# Altium schematic sheet BlueBox-Amp [PA].SchDoc
size A
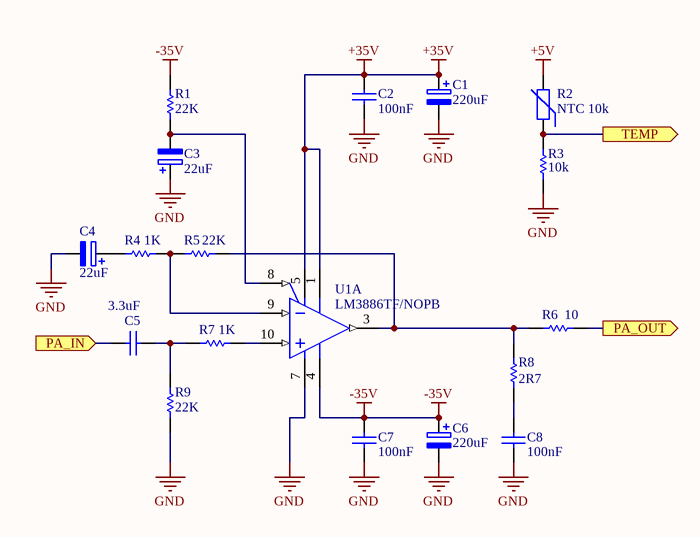
[diagram p0: BlueBox-Amp [PA].SchDoc]

## Parts
C1  value 220uF  [E5-10,5]  (hidden comment: Capacitor Polarized)
C2  value 100nF  [CAPC0603(1608)100_L]  (hidden comment: CAP 100nF 50V 0603(1608))
C3  value 22uF  [EC P2-D5-H11]  (hidden comment: Capacitor Polarized)
C4  value 22uF  [EC P2-D5-H11]  (hidden comment: Capacitor Polarized)
C5  value 3.3uF  [CAPC1210(3225)280_L]  (hidden comment: CAP 3.3uF 50V 1210(3225))
C6  value 220uF  [E5-10,5]  (hidden comment: Capacitor Polarized)
C7  value 100nF  [CAPC0603(1608)100_L]  (hidden comment: CAP 100nF 50V 0603(1608))
C8  value 100nF  [CAPC0603(1608)100_L]  (hidden comment: CAP 100nF 50V 0603(1608))
R1  value 22K  [RESC0603(1608)_L]  (hidden comment: 22K 1% 0603(1608))
R2  NTC 10k  [HDR1X2]
R3  value 10k  [RESC0603(1608)_N]  (hidden comment: 10K 1% 0603(1608))
R4  value 1K  [RESC0603(1608)_M]  (hidden comment: 1K 1% 0603(1608))
R5  value 22K  [RESC0603(1608)_L]  (hidden comment: 22K 1% 0603(1608))
R6  value 10  [RESC2512(6432)_L]  (hidden comment: 10R 5% 2512(6432))
R7  value 1K  [RESC0603(1608)_M]  (hidden comment: 1K 1% 0603(1608))
R8  value 2R7  [RESC2512(6432)_L]  (hidden comment: 2R7 5% 2512(6432))
R9  value 22K  [RESC0603(1608)_L]  (hidden comment: 22K 1% 0603(1608))
U1  LM3886TF/NOPB  [TI-NDA11]  (part A of 2)

## Ports
PA_IN, PA_OUT, TEMP

## Nets
+5V: R2.2
+35V: C1.1 C2.2 U1.1(V+) U1.5(V+)
-35V: C6.1 C7.2 R1.1 U1.4(V-)
GND: C1.2 C2.1 C3.1 C4.2 C6.2 C7.1 C8.2 R3.1 R9.2 U1.7(GND)
PA_IN: C5.1 ; port PA_IN
PA_OUT: R6.2 ; port PA_OUT
TEMP: R2.1 R3.2 ; port TEMP
NetC3_2: C3.2 R1.2 U1.8(MUTE)
NetC4_1: C4.1 R4.1
NetC5_2: C5.2 R7.1 R9.1
NetC8_1: C8.1 R8.1
NetR4_2: R4.2 R5.1 U1.9(VIN-)
NetR5_2: R5.2 R6.1 R8.2 U1.3(OUTPUT)
NetR7_2: R7.2 U1.10(VIN+)

## Library data of the parts
C1 C3 C4 C6 = Capacitor Polarized: Polarized Capacitor
C2 C7 C8 = CMP-1035-02591-1: CAP 100nF 50V ±5% 0603 (1608 Metric) Thickness 1mm SMD; Case-Metric: 1608; Case-EIA: 0603; Rated Voltage: 50 V; Max Thickness: 1 mm; Tolerance: ±5%; Technology: SMT
C5 = CMP-1038-02126-1: CAP 3.3uF 50V ±10% 1210 (3225 Metric) Thickness 2.8mm SMD; Case-Metric: 3225; Case-EIA: 1210; Technology: SMT; Max Thickness: 2.8 mm; Rated Voltage: 50 V; Tolerance: ±10%
R1 R5 R9 = CMP-1012-00659-1: 22K 0.1W 1% 0603 (1608 Metric)  SMD; Case-EIA: 0603; Case-Metric: 1608; Technology: SMT; Power: 0.1 W; Tolerance: 1 %
R2 = NTCALUG02A103F: Thermistors - NTC 10k; Manufacturer: Vishay / BC Components; Resistance: 10 kOhms; Tolerance: 1 %; Value: *; Manufacturer Part Number: NTCALUG02A103F; RoHS: RoHS Compliant By Exemption; Category: Thermistors - NTC; Dimensions: 8.5 mm Dia. x 16.8 mm L x 0.8 mm H; Operating Temperature Range: - 55 C to + 125 C; Packaging: Bulk; Series: NTCALUGxxA; Termination Style: Wire; Type: NTC; Brand: Vishay / BC Components; Standard Pack Qty: 500; RoHS - Mouser: E; Minimum Order Quantity: 1; Reeling: False; ComponentLink1URL: http://www.mouser.com/ds/2/427/23810294-105180.pdf; ComponentLink1Description: http://www.mouser.com/ds/2/427/23810294-105180.pdf; Supplier 1: Mouser; Supplier Part Number 1: 594-NTCALUG02A103F; Stock 1: 9996; Pricing 1: 1=1.66, 10=1.17, 50=1.09, 100=0.970, 200=0.943, 500=0.906, 1000=0.860, 2000=0.849 (AUD)
R3 = CMP-1012-00623-1: 10K 0.1W 1% 0603 (1608 Metric)  SMD; Case-EIA: 0603; Case-Metric: 1608; Power: 0.1 W; Tolerance: 1 %; Technology: SMT
R4 R7 = CMP-1012-00510-1: 1K 0.1W 1% 0603 (1608 Metric)  SMD; Case-Metric: 1608; Case-EIA: 0603; Technology: SMT; Tolerance: 1 %; Power: 0.1 W
R6 = CMP-1018-00026-1: 10R 1W 5% 2512 (6432 Metric)  SMD; Case-EIA: 2512; Case-Metric: 6432; Power: 1 W; Technology: SMT; Tolerance: 5 %
R8 = CMP-1018-00012-1: 2R7 1W 5% 2512 (6432 Metric)  SMD; Case-EIA: 2512; Case-Metric: 6432; Tolerance: 5 %; Technology: SMT; Power: 1 W
U1 = CMP-0994-00114-1: High-Performance 68 W Audio Power Amplifier with Mute, 0 to 70 degC, 11-pin FM (NDA11), Pb-Free (RoHS Exempt); Manufacturer: Texas Instruments; Input Type: Analog; SubFamily: Mid/High-Power Amplifier; PackageVersion: Rev. D, 02/2013; PartNumber: LM3886TF/NOPB; DatasheetVersion: SNAS091C; Eco-Plan: Pb-Free (RoHS Exempt); Mounting Technology: Through Hole; ComponentLink3URL: http://www.ti.com/lit/ml/mmsf015/mmsf015.pdf; ComponentLink1Description: Manufacturer URL; PackageDescription: 11-Pin Metal Flange Mount, Body 20.02 x 4.5 mm, Pitch 1.7 mm; ComponentLink1URL: http://www.ti.com/; ComponentLink2URL: http://www.ti.com/general/docs/lit/getliterature.tsp?genericPartNumber=LM3886&fileType=pdf; ComponentLink3Description: Package Specification; ComponentLink2Description: Datasheet; PackageReference: NDA11; PartId: 1